# Altium schematic sheet USB_Headers.SchDoc
size A
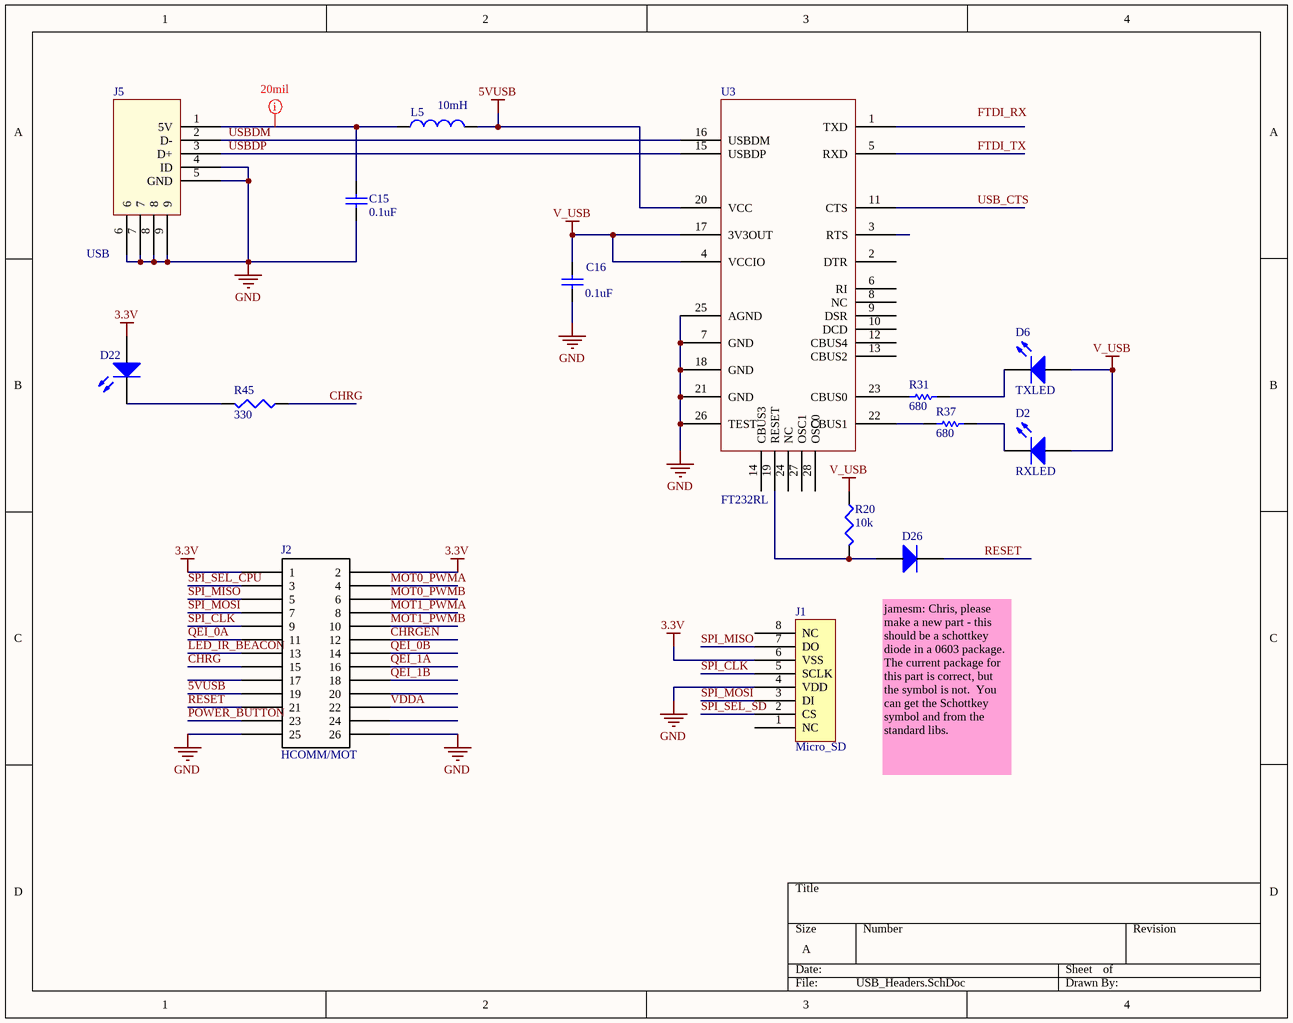
[diagram p0: USB_Headers.SchDoc]

## Parts
C15  value 0.1uF  [CAPC1005L]
C16  value 0.1uF  [CAPC1005L]
D2  RXLED  [INDC2012L]
D6  TXLED  [INDC2012L]
D22  Charge  [INDC2012L]  (value not drawn)
D26  DIODE  [SurfaceMount(603)]  (value not drawn)
J1  Micro_SD  [MICRO_SD]
J2  HCOMM/MOT  [HeaderSM 13x2]
J5  USB  [USB Minib (thru-hole)]
L5  value 10mH  [INDC2012L]  (hidden comment: Inductor)
R20  value 10k  [RESC1608L]  (hidden comment: Res3)
R31  value 680  [RESC1608L]
R37  value 680  [RESC1608L]
R45  value 330  [RESC1608L]  (hidden comment: Res3)
U3  FT232RL  [SSOP-28]

## Nets
3.3V: D22.1(A) J1.6(VSS) J2.1 J2.2
5VUSB: J2.19 L5.2 U3.20(VCC)
GND: C15.1 C16.1 J1.4(VDD) J2.25 J2.26 J5.4(ID) J5.5(GND) J5.6 J5.7 J5.8 J5.9 U3.7(GND) U3.18(GND) U3.21(GND) U3.25(AGND) U3.26(TEST)
V_USB: C16.2 D2.1(A) D6.1(A) R20.1 U3.4(VCCIO) U3.17(3V3OUT)
CHRG: J2.15 R45.1
CHRGEN: J2.12
FTDI_TX: U3.5(RXD)
LED_IR_BEACON: J2.13
MOT0_PWMA: J2.4
MOT0_PWMB: J2.6
MOT1_PWMA: J2.8
MOT1_PWMB: J2.10
POWER_BUTTON: J2.23
QEI_0A: J2.11
QEI_0B: J2.14
QEI_1A: J2.16
QEI_1B: J2.18
RESET: D26.2(K) J2.21
SPI_CLK: J1.5(SCLK) J2.9
SPI_MISO: J1.7(DO) J2.5
SPI_MOSI: J1.3(DI) J2.7
SPI_SEL_CPU: J2.3
SPI_SEL_SD: J1.2(CS)
USB_CTS: U3.11(CTS)
USBDM: J5.2(D-) U3.16(USBDM)
USBDP: J5.3(D+) U3.15(USBDP)
VDDA: J2.22
NetC15_2: C15.2 J5.1(5V) L5.1
NetD2_2: D2.2(K) R37.2
NetD6_2: D6.2(K) R31.2
NetD22_2: D22.2(K) R45.2
NetD26_1: D26.1(A) R20.2 U3.19(RESET)
NetR31_1: R31.1 U3.23(CBUS0)
NetR37_1: R37.1 U3.22(CBUS1)

Not connected (* = marked no-connect by the designer): J1 1(NC) 8(NC); J2 17 20 24; U3 1(TXD) 2(DTR) 3(RTS) 6(RI) 8(NC) 9(DSR) 10(DCD) 12(CBUS4) 13(CBUS2) 14(CBUS3) 24(NC) 27(OSC1) 28(OSC0)

## Layout directives
rule Width Constraint [Pref Width = 10mil    Min Width = 10mil    Max Width = 20mil]: NetC15_2

## Notes on the sheet
- jamesm: Chris, please make a new part - this should be a schottkey diode in a 0603 package.  The current package for this part is correct, but the symbol is not.  You can get the Schottkey symbol and from the standard libs.
- Labels drawn without touching a wire or pin: FTDI_RX

## Library data of the parts
C15 C16 = Cap: Capacitor; Published: 8-Jun-2000; LatestRevisionDate: 17-Jul-2002; LatestRevisionNote: Re-released for DXP Platform.; PackageReference: RAD-0.3; Publisher: Altium Limited
D2 D6 D22 = LED2: Typical RED, GREEN, YELLOW, AMBER GaAs LED; Published: 8-Jun-2000; LatestRevisionDate: 17-Jul-2002; LatestRevisionNote: Re-released for DXP Platform.; PackageVersion: Feb-2002; PackageReference: 3.2X1.6X1.1; Publisher: Altium Limited
J2 = HCOMM/HMOT: Header, 2X20, 50mil, IDC
J5 = USB-ConnTH
L5 = Inductor: Code_IEC: 1005; Published: 8-Jun-2000; LatestRevisionDate: 29-May-2009; LatestRevisionNote: IPC-7351 Footprint Added.; PackageReference: 0402-A; Publisher: Altium Limited; PackageDescription: Chip Inductor; Code_JEITA: 0402
R20 R45 = Res3: Resistor; Published: 8-Jun-2000; LatestRevisionDate: 29-May-2009; LatestRevisionNote: IPC-7351 Footprint Added.; PackageReference: J1-0603; Publisher: Altium Limited; PackageDescription: Chip Resistor
R31 R37 = Res1: Resistor; Published: 8-Jun-2000; LatestRevisionDate: 17-Jul-2002; LatestRevisionNote: Re-released for DXP Platform.; PackageReference: AXIAL-0.3; Publisher: Altium Limited